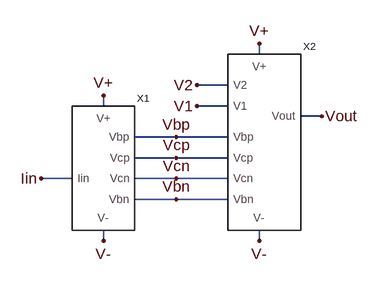
[diagram p0: schematic Opamp.asc]
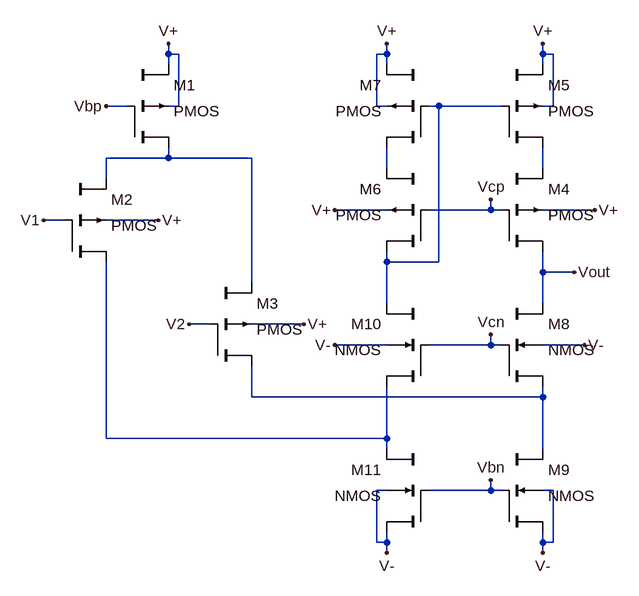
[diagram p1: sub-circuit fcdamp.asc]
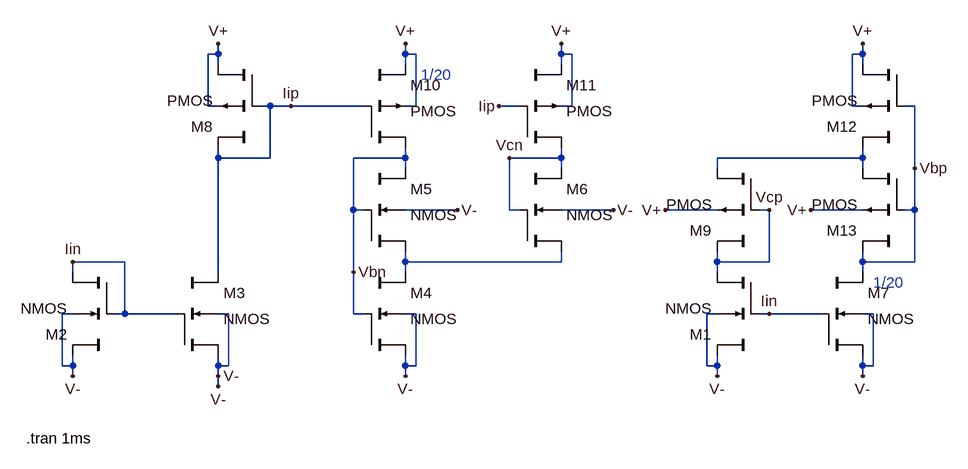
[diagram p2: sub-circuit bias.asc]
Opamp.asc, the LTspice schematic file:
Version 4
SHEET 1 880 680
WIRE 352 0 352 -16
WIRE 304 48 256 48
WIRE 112 80 112 64
WIRE 304 80 256 80
WIRE 448 96 416 96
WIRE 224 128 160 128
WIRE 304 128 224 128
WIRE 224 160 160 160
WIRE 304 160 224 160
WIRE 64 192 16 192
WIRE 224 192 160 192
WIRE 304 192 224 192
WIRE 224 224 160 224
WIRE 304 224 224 224
WIRE 112 288 112 272
WIRE 352 288 352 272
FLAG 352 -16 V+
FLAG 112 64 V+
FLAG 256 80 V1
FLAG 256 48 V2
FLAG 16 192 Iin
FLAG 224 224 Vbn
FLAG 224 192 Vcn
FLAG 224 160 Vcp
FLAG 224 128 Vbp
FLAG 448 96 Vout
FLAG 112 288 V-
FLAG 352 288 V-
SYMBOL FCDAmp 336 160 R0
SYMATTR InstName X2
SYMBOL Bias 96 160 R0
SYMATTR InstName X1

fcdamp.asc, the sub-circuit schematic file:
Version 4
SHEET 1 880 808
WIRE 144 -32 144 -48
WIRE 160 -32 144 -32
WIRE 480 -32 480 -48
WIRE 480 -32 464 -32
WIRE 720 -32 720 -48
WIRE 736 -32 720 -32
WIRE 144 -16 144 -32
WIRE 480 -16 480 -32
WIRE 720 -16 720 -32
WIRE 80 48 48 48
WIRE 160 48 160 -32
WIRE 160 48 144 48
WIRE 464 48 464 -32
WIRE 480 48 464 48
WIRE 560 48 544 48
WIRE 656 48 560 48
WIRE 736 48 736 -32
WIRE 736 48 720 48
WIRE 144 128 144 112
WIRE 144 128 48 128
WIRE 272 128 144 128
WIRE 480 144 480 112
WIRE 720 144 720 112
WIRE 48 160 48 128
WIRE 480 208 400 208
WIRE 640 208 640 192
WIRE 640 208 544 208
WIRE 656 208 640 208
WIRE 800 208 720 208
WIRE -16 224 -48 224
WIRE 128 224 48 224
WIRE 480 288 480 272
WIRE 560 288 560 48
WIRE 560 288 480 288
WIRE 720 304 720 272
WIRE 768 304 720 304
WIRE 272 320 272 128
WIRE 480 352 480 288
WIRE 720 352 720 304
WIRE 208 384 176 384
WIRE 352 384 272 384
WIRE 480 416 400 416
WIRE 640 416 640 400
WIRE 640 416 544 416
WIRE 656 416 640 416
WIRE 784 416 720 416
WIRE 272 496 272 448
WIRE 720 496 720 480
WIRE 720 496 272 496
WIRE 48 560 48 288
WIRE 480 560 480 480
WIRE 480 560 48 560
WIRE 480 576 480 560
WIRE 720 576 720 496
WIRE 480 640 464 640
WIRE 640 640 640 624
WIRE 640 640 544 640
WIRE 656 640 640 640
WIRE 736 640 720 640
WIRE 464 720 464 640
WIRE 480 720 480 704
WIRE 480 720 464 720
WIRE 720 720 720 704
WIRE 736 720 736 640
WIRE 736 720 720 720
WIRE 480 736 480 720
WIRE 720 736 720 720
FLAG 128 224 V+
FLAG 352 384 V+
FLAG 400 208 V+
FLAG 480 -48 V+
FLAG 720 -48 V+
FLAG 144 -48 V+
FLAG 400 416 V-
FLAG 784 416 V-
FLAG 720 736 V-
FLAG 480 736 V-
FLAG 800 208 V+
FLAG 768 304 Vout
FLAG -48 224 V1
FLAG 176 384 V2
FLAG 48 48 Vbp
FLAG 640 192 Vcp
FLAG 640 400 Vcn
FLAG 640 624 Vbn
SYMBOL cktsym\\pmos4 144 48 R0
SYMATTR InstName M1
SYMATTR Value2 l=1.8um w=36um
SYMBOL cktsym\\pmos4 48 224 R0
SYMATTR InstName M2
SYMATTR Value2 l=1.8um w=36um
SYMBOL cktsym\\pmos4 272 384 R0
SYMATTR InstName M3
SYMATTR Value2 l=1.8um w=36um
SYMBOL cktsym\\pmos4 720 208 R0
SYMATTR InstName M4
SYMATTR Value2 l=1.8um w=36um
SYMBOL cktsym\\pmos4 720 48 R0
SYMATTR InstName M5
SYMATTR Value2 l=1.8um w=36um
SYMBOL cktsym\\pmos4 480 208 M0
SYMATTR InstName M6
SYMATTR Value2 l=1.8um w=36um
SYMBOL cktsym\\pmos4 480 48 M0
SYMATTR InstName M7
SYMATTR Value2 l=1.8um w=36um
SYMBOL cktsym\\nmos4 720 416 R0
SYMATTR InstName M8
SYMATTR Value2 l=1.8um w=36um
SYMBOL cktsym\\nmos4 720 640 R0
SYMATTR InstName M9
SYMATTR Value2 l=1.8um w=36um
SYMBOL cktsym\\nmos4 480 416 M0
SYMATTR InstName M10
SYMATTR Value2 l=1.8um w=36um
SYMBOL cktsym\\nmos4 480 640 M0
SYMATTR InstName M11
SYMATTR Value2 l=1.8um w=36um

bias.asc, the sub-circuit schematic file:
Version 4
SHEET 1 880 680
WIRE -752 -240 -752 -256
WIRE -752 -240 -768 -240
WIRE -464 -240 -464 -256
WIRE -448 -240 -464 -240
WIRE -224 -240 -224 -256
WIRE -208 -240 -224 -240
WIRE 240 -240 240 -256
WIRE 240 -240 224 -240
WIRE -752 -224 -752 -240
WIRE -464 -224 -464 -240
WIRE -224 -224 -224 -240
WIRE 240 -224 240 -240
WIRE -768 -160 -768 -240
WIRE -752 -160 -768 -160
WIRE -672 -160 -688 -160
WIRE -640 -160 -672 -160
WIRE -528 -160 -640 -160
WIRE -448 -160 -448 -240
WIRE -448 -160 -464 -160
WIRE -288 -160 -320 -160
WIRE -208 -160 -208 -240
WIRE -208 -160 -224 -160
WIRE 224 -160 224 -240
WIRE 240 -160 224 -160
WIRE 320 -160 304 -160
WIRE -752 -80 -752 -96
WIRE -672 -80 -672 -160
WIRE -672 -80 -752 -80
WIRE -464 -80 -464 -96
WIRE -464 -80 -544 -80
WIRE -224 -80 -224 -96
WIRE -224 -80 -304 -80
WIRE 240 -80 240 -96
WIRE 240 -80 16 -80
WIRE -464 -64 -464 -80
WIRE -224 -64 -224 -80
WIRE 16 -64 16 -80
WIRE 240 -64 240 -80
WIRE 320 -64 320 -160
WIRE -544 0 -544 -80
WIRE -528 0 -544 0
WIRE -384 0 -464 0
WIRE -304 0 -304 -80
WIRE -288 0 -304 0
WIRE -144 0 -224 0
WIRE 16 0 -64 0
WIRE 96 0 80 0
WIRE 240 0 160 0
WIRE 320 0 320 -64
WIRE 320 0 304 0
WIRE -896 80 -976 80
WIRE -464 80 -464 64
WIRE -224 80 -224 64
WIRE -224 80 -464 80
WIRE 16 80 16 64
WIRE 96 80 96 0
WIRE 96 80 16 80
WIRE 240 80 240 64
WIRE 320 80 320 0
WIRE 320 80 240 80
WIRE -976 96 -976 80
WIRE -752 96 -752 -80
WIRE -544 96 -544 0
WIRE -464 96 -464 80
WIRE 16 96 16 80
WIRE 240 96 240 80
WIRE -976 160 -992 160
WIRE -896 160 -896 80
WIRE -896 160 -912 160
WIRE -816 160 -896 160
WIRE -736 160 -752 160
WIRE -544 160 -544 96
WIRE -528 160 -544 160
WIRE -448 160 -464 160
WIRE 16 160 0 160
WIRE 96 160 80 160
WIRE 176 160 96 160
WIRE 256 160 240 160
WIRE -992 240 -992 160
WIRE -976 240 -976 224
WIRE -976 240 -992 240
WIRE -752 240 -752 224
WIRE -736 240 -736 160
WIRE -736 240 -752 240
WIRE -464 240 -464 224
WIRE -448 240 -448 160
WIRE -448 240 -464 240
WIRE 0 240 0 160
WIRE 16 240 16 224
WIRE 16 240 0 240
WIRE 240 240 240 224
WIRE 256 240 256 160
WIRE 256 240 240 240
WIRE -976 256 -976 240
WIRE -752 256 -752 240
WIRE -464 256 -464 240
WIRE 16 256 16 240
WIRE 240 256 240 240
WIRE -752 272 -752 256
FLAG -752 -256 V+
FLAG -464 -256 V+
FLAG -224 -256 V+
FLAG -752 272 V-
FLAG -976 256 V-
FLAG -752 256 V-
FLAG -464 256 V-
FLAG 16 256 V-
FLAG 240 256 V-
FLAG -144 0 V-
FLAG -384 0 V-
FLAG -64 0 V+
FLAG 240 -256 V+
FLAG 160 0 V+
FLAG -304 -80 Vcn
FLAG 96 0 Vcp
FLAG -544 96 Vbn
FLAG 320 -64 Vbp
FLAG -976 80 Iin
FLAG 96 160 Iin
FLAG -640 -160 Iip
FLAG -320 -160 Iip
SYMBOL cktsym\\nmos4 16 160 R180
SYMATTR InstName M1
SYMATTR Value2 l=1.8um w=36um
SYMBOL cktsym\\nmos4 -976 160 R180
SYMATTR InstName M2
SYMATTR Value2 l=1.8um w=36um
SYMBOL cktsym\\nmos4 -752 160 R0
SYMATTR InstName M3
SYMATTR Value2 l=1.8um w=36um
SYMBOL cktsym\\nmos4 -464 160 R0
SYMATTR InstName M4
SYMATTR Value2 l=1.8um w=36um
SYMBOL cktsym\\nmos4 -464 0 R0
SYMATTR InstName M5
SYMATTR Value2 l=1.8um w=36um
SYMBOL cktsym\\nmos4 -224 0 R0
SYMATTR InstName M6
SYMATTR Value2 l=1.8um w=36um
SYMBOL cktsym\\nmos4 240 160 R0
SYMATTR InstName M7
SYMATTR Value2 l=1.8um w=1.8um
SYMBOL cktsym\\pmos4 -752 -160 R180
SYMATTR InstName M8
SYMATTR Value2 l=1.8um w=36um
SYMBOL cktsym\\pmos4 16 0 R180
SYMATTR InstName M9
SYMATTR Value2 l=1.8um w=36um
SYMBOL cktsym\\pmos4 -464 -160 R0
SYMATTR InstName M10
SYMATTR Value2 l=1.8um w=1.8um
SYMBOL cktsym\\pmos4 -224 -160 R0
SYMATTR InstName M11
SYMATTR Value2 l=1.8um w=36um
SYMBOL cktsym\\pmos4 240 -160 R180
SYMATTR InstName M12
SYMATTR Value2 l=1.8um w=36um
SYMBOL cktsym\\pmos4 240 0 R180
SYMATTR InstName M13
SYMATTR Value2 l=1.8um w=36um
TEXT -440 -208 Left 2 ;1/20
TEXT 256 112 Left 2 ;1/20
TEXT -1048 352 Left 2 !.tran 1ms

The netlist it stands for:
* Opamp.asc
XX2 V+ V- V1 Vbn Vcn Vcp Vbp V2 Vout fcdamp
XX1 V- V+ Vbn Vbp Vcp Vcn Iin bias

* block symbol definitions
.subckt fcdamp V+ V- V1 Vbn Vcn Vcp Vbp V2 Vout
M1 N002 Vbp V+ V+ PMOS l=1.8um w=36um
M2 N006 V1 N002 V+ PMOS l=1.8um w=36um
M3 N005 V2 N002 V+ PMOS l=1.8um w=36um
M4 Vout Vcp N004 V+ PMOS l=1.8um w=36um
M5 N004 N001 V+ V+ PMOS l=1.8um w=36um
M6 N001 Vcp N003 V+ PMOS l=1.8um w=36um
M7 N003 N001 V+ V+ PMOS l=1.8um w=36um
M8 Vout Vcn N005 V- NMOS l=1.8um w=36um
M9 N005 Vbn V- V- NMOS l=1.8um w=36um
M10 N001 Vcn N006 V- NMOS l=1.8um w=36um
M11 N006 Vbn V- V- NMOS l=1.8um w=36um
.ends fcdamp

.subckt bias V- V+ Vbn Vbp Vcp Vcn Iin
M1 V- Iin Vcp V- NMOS l=1.8um w=36um
M2 V- Iin Iin V- NMOS l=1.8um w=36um
M3 Iip Iin V- V- NMOS l=1.8um w=36um
M4 N002 Vbn V- V- NMOS l=1.8um w=36um
M5 Vbn Vbn N002 V- NMOS l=1.8um w=36um
M6 Vcn Vcn N002 V- NMOS l=1.8um w=36um
M7 Vbp Iin V- V- NMOS l=1.8um w=1.8um
M8 V+ Iip Iip V+ PMOS l=1.8um w=36um
M9 N001 Vcp Vcp V+ PMOS l=1.8um w=36um
M10 Vbn Iip V+ V+ PMOS l=1.8um w=1.8um
M11 Vcn Iip V+ V+ PMOS l=1.8um w=36um
M12 V+ Vbp N001 V+ PMOS l=1.8um w=36um
M13 N001 Vbp Vbp V+ PMOS l=1.8um w=36um
* 1/20
* 1/20
.tran 1ms
.ends bias

.model NMOS NMOS
.model PMOS PMOS
.lib standard.mos
.backanno
.end